# Altium schematic sheet [06] - HDMI OUTPUT.SchDoc
size A3; DocumentNumber: 6; SheetNumber: 6; SheetTotal: 18
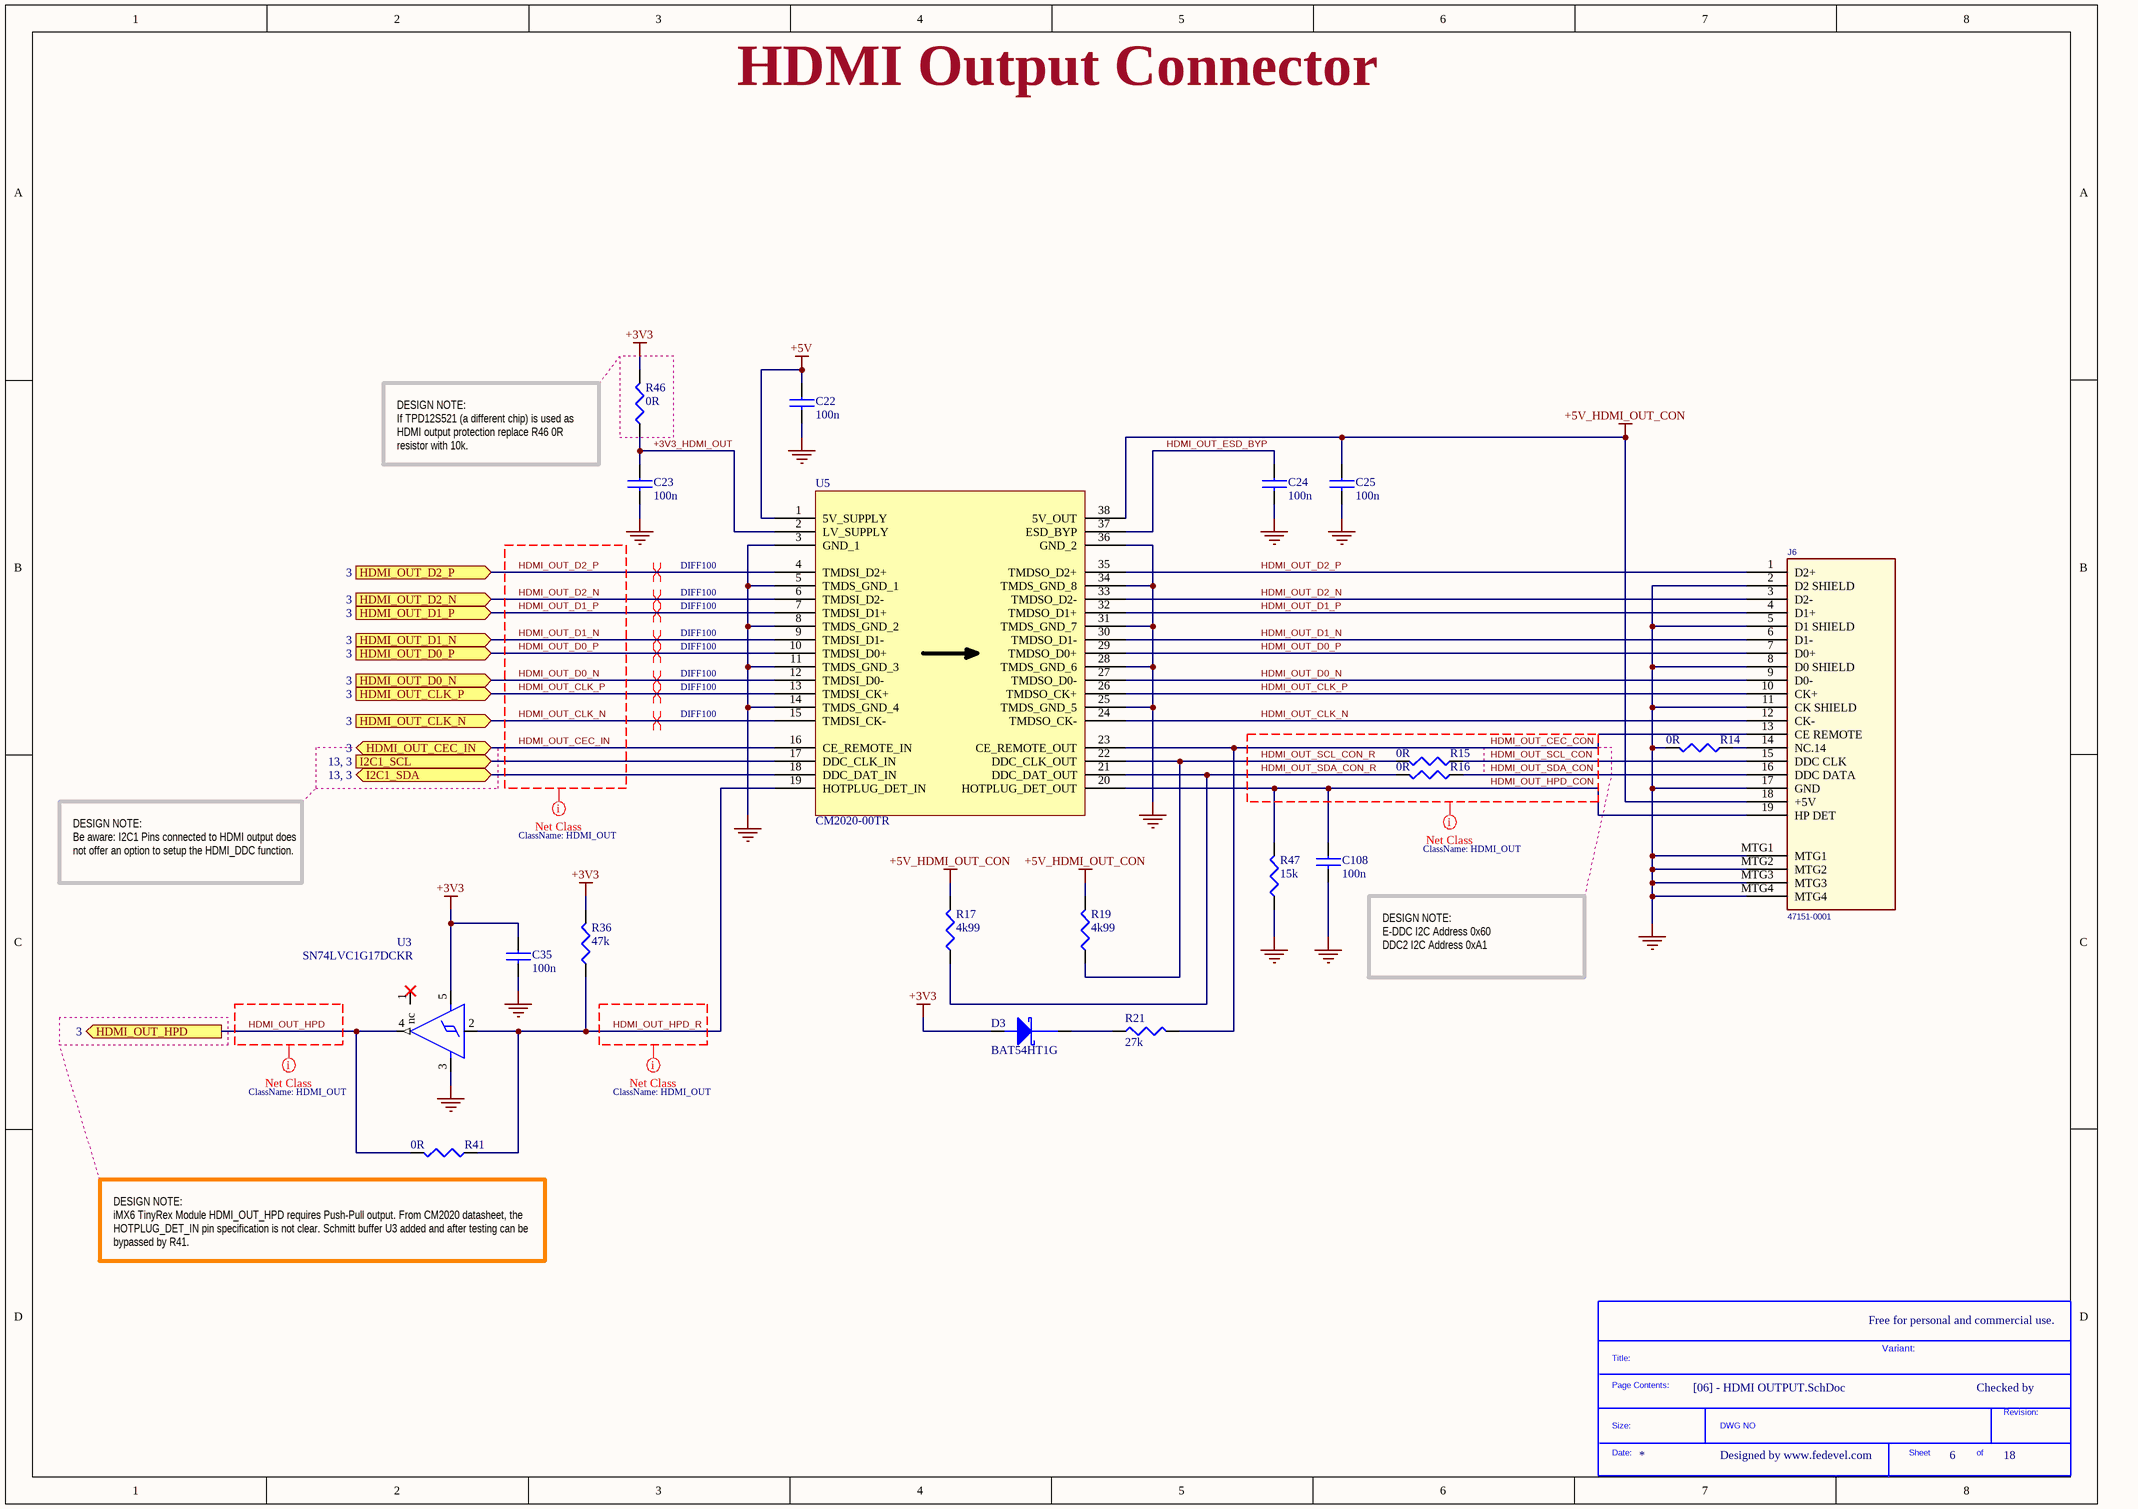
[diagram p0: [06] - HDMI OUTPUT.SchDoc]

## Parts
*  SDTitleBlock  (value not drawn)  (graphical)
C22  100n  [C0402]
C23  100n  [C0402]
C24  100n  [C0402]
C25  100n  [C0402]
C35  100n  [C0402]
C108  100n  [C0402]
D3  BAT54HT1G  [SOD323]
J6  47151-0001  [HDMI V1.1]
R14  0R  [R0402]
R15  0R  [R0402]
R16  0R  [R0402]
R17  4k99  [R0402]
R19  4k99  [R0402]
R21  27k  [R0402]
R36  47k  [R0402]
R41  0R  [R0402]
R46  0R  [R0402]
R47  15k  [R0402]
U3  SN74LVC1G17DCKR  [SC70_5]
U5  CM2020-00TR  [TSSOP_38]

## Ports
HDMI_OUT_CEC_IN (bidir, see 3), HDMI_OUT_CLK_N (in, see 3), HDMI_OUT_CLK_P (in, see 3), HDMI_OUT_D0_N (in, see 3), HDMI_OUT_D0_P (in, see 3), HDMI_OUT_D1_N (in, see 3), HDMI_OUT_D1_P (in, see 3), HDMI_OUT_D2_N (in, see 3), HDMI_OUT_D2_P (in, see 3), HDMI_OUT_HPD (out, see 3), I2C1_SCL (see 13, 3), I2C1_SDA (bidir, see 13, 3)

## Nets
+3V3: C35.1 D3.2(Anode) R36.2 R46.2 U3.5(NC1)
+5V: C22.1 U5.1(5V_SUPPLY)
+5V_HDMI_OUT_CON: C25.1 J6.18(+5V) R17.2 R19.2 U5.38(5V_OUT)
GND: C22.2 C23.2 C24.2 C25.2 C35.2 C108.2 J6.2(D2_SHIELD) J6.5(D1_SHIELD) J6.8(D0_SHIELD) J6.11(CK_SHIELD) J6.17(GND) J6.MTG1 J6.MTG2 J6.MTG3 J6.MTG4 R14.2 R47.1 U3.3(GND) U5.3(GND_1) U5.5(TMDS_GND_1) U5.8(TMDS_GND_2) U5.11(TMDS_GND_3) U5.14(TMDS_GND_4) U5.25(TMDS_GND_5) U5.28(TMDS_GND_6) U5.31(TMDS_GND_7) U5.34(TMDS_GND_8) U5.36(GND_2)
+3V3_HDMI_OUT: C23.1 R46.1 U5.2(LV_SUPPLY)
HDMI_OUT_CEC_CON: J6.13(CE_REMOTE) R21.2 U5.23(CE_REMOTE_OUT)
HDMI_OUT_CEC_IN: U5.16(CE_REMOTE_IN) ; port HDMI_OUT_CEC_IN
HDMI_OUT_CLK_N: J6.12(CK-) U5.15(TMDSI_CK-) U5.24(TMDSO_CK-) ; port HDMI_OUT_CLK_N
HDMI_OUT_CLK_P: J6.10(CK+) U5.13(TMDSI_CK+) U5.26(TMDSO_CK+) ; port HDMI_OUT_CLK_P
HDMI_OUT_D0_N: J6.9(D0-) U5.12(TMDSI_D0-) U5.27(TMDSO_D0-) ; port HDMI_OUT_D0_N
HDMI_OUT_D0_P: J6.7(D0+) U5.10(TMDSI_D0+) U5.29(TMDSO_D0+) ; port HDMI_OUT_D0_P
HDMI_OUT_D1_N: J6.6(D1-) U5.9(TMDSI_D1-) U5.30(TMDSO_D1-) ; port HDMI_OUT_D1_N
HDMI_OUT_D1_P: J6.4(D1+) U5.7(TMDSI_D1+) U5.32(TMDSO_D1+) ; port HDMI_OUT_D1_P
HDMI_OUT_D2_N: J6.3(D2-) U5.6(TMDSI_D2-) U5.33(TMDSO_D2-) ; port HDMI_OUT_D2_N
HDMI_OUT_D2_P: J6.1(D2+) U5.4(TMDSI_D2+) U5.35(TMDSO_D2+) ; port HDMI_OUT_D2_P
HDMI_OUT_ESD_BYP: C24.1 U5.37(ESD_BYP)
HDMI_OUT_HPD: R41.2 U3.4(O) ; port HDMI_OUT_HPD
HDMI_OUT_HPD_CON: C108.1 J6.19(HP_DET) R47.2 U5.20(HOTPLUG_DET_OUT)
HDMI_OUT_HPD_R: R36.1 R41.1 U3.2(I) U5.19(HOTPLUG_DET_IN)
HDMI_OUT_SCL_CON: J6.15(DDC_CLK) R15.1
HDMI_OUT_SCL_CON_R: R15.2 R19.1 U5.22(DDC_CLK_OUT)
HDMI_OUT_SDA_CON: J6.16(DDC_DATA) R16.1
HDMI_OUT_SDA_CON_R: R16.2 R17.1 U5.21(DDC_DAT_OUT)
I2C1_SCL: U5.17(DDC_CLK_IN) ; port I2C1_SCL
I2C1_SDA: U5.18(DDC_DAT_IN) ; port I2C1_SDA
NetD3_1: D3.1(Cathode) R21.1
NetJ6_14: J6.14(NC.14) R14.1

Not connected (* = marked no-connect by the designer): U3 1(nc)*

## Layout directives
differential pair; net class DIFF100: HDMI_OUT_CLK_N, HDMI_OUT_CLK_P, HDMI_OUT_D0_N, HDMI_OUT_D0_P, HDMI_OUT_D1_N, HDMI_OUT_D1_P, HDMI_OUT_D2_N, HDMI_OUT_D2_P
net class HDMI_OUT: HDMI_OUT_CEC_CON, HDMI_OUT_CEC_IN, HDMI_OUT_CLK_N, HDMI_OUT_CLK_P, HDMI_OUT_D0_N, HDMI_OUT_D0_P, HDMI_OUT_D1_N, HDMI_OUT_D1_P, HDMI_OUT_D2_N, HDMI_OUT_D2_P, HDMI_OUT_HPD, HDMI_OUT_HPD_CON, HDMI_OUT_HPD_R, HDMI_OUT_SCL_CON, HDMI_OUT_SCL_CON_R, HDMI_OUT_SDA_CON, HDMI_OUT_SDA_CON_R

## Notes on the sheet
- HDMI Output Connector
- DESIGN NOTE:
  If TPD12S521 (a different chip) is used as HDMI output protection replace R46 0R resistor with 10k.
- DESIGN NOTE:
  Be aware: I2C1 Pins connected to HDMI output does not offer an option to setup the HDMI_DDC function.
- DESIGN NOTE:
  E-DDC I2C Address 0x60
  DDC2 I2C Address 0xA1
- (near R41) DESIGN NOTE:
  iMX6 TinyRex Module HDMI_OUT_HPD requires Push-Pull output. From CM2020 datasheet, the HOTPLUG_DET_IN pin specification is not clear. Schmitt buffer U3 added and after testing can be bypassed by R41.
- Free for personal and commercial use.
- Variant:
- Checked by
- Designed by www.fedevel.com
- (in symbol SDTitleBlock) Title:; Page Contents:; Revision:; Size:; DWG NO; Date:; Sheet; of

## Library data of the parts
C22-C25 C35 C108 = C1005X5R1H104K: CAP CER .10UF 50V X5R 10% 0402; Manufacturer: TDK Corporation; Capacitance: 0.1µF; Value: 100nF; .Checked PCB: used; Category: Capacitors; Supplier Part Number: 445-5942-1-ND; Manufacturer Part Number: C1005X5R1H104K; Operating Temperature: -55°C ~ 85°C; Package / Case: 0402 (1005 Metric); Price 1k [$]: 0.02340; .Checked SCH: used; Voltage - Rated: 50V; Supplier: Digikey; Supplier 1: Digi-Key; Supplier Part Number 1: 445-5942-1-ND; RoHS: RoHS Compliant; Stock 1: 106926; Pricing 1: 1=0.27, 10=0.18, 100=0.072, 250=0.05176, 500=0.0369, 1000=0.027 (USD); Tolerance: ±10%; Temperature Coefficient: X5R; Mounting Type: Surface Mount, MLCC; Applications: General Purpose; Ratings: -; Size / Dimension: 0.039" L x 0.020" W (1.00mm x 0.50mm); Height - Seated (Max): -; Thickness (Max): 0.022" (0.55mm); Lead Spacing: -; Features: -; Packaging: Cut Tape (CT); Lead Style: -; ComponentLink1URL: http://www.tdk.co.jp/tefe02/e412_c.pdf; ComponentLink1Description: http://www.tdk.co.jp/tefe02/e412_c.pdf
D3 = BAT54HT1G: DIODE SCHOTTKY 30V 0.2A SOD323; Manufacturer: Fairchild Semiconductor; Current - Average Rectified (Io): 200mA; Voltage - Forward (Vf) (Max) @ If: 800mV @ 100mA; Speed: Small Signal =< 200mA (Io), Any Speed; Reverse Recovery Time (trr): 5ns; Current - Reverse Leakage @ Vr: 2µA @ 25V; Capacitance @ Vr, F: 10pF @ 1V, 1MHz; Thermal Resistance: 600°C/W Ja; .Creator: MM; .Checked PCB: used; Supplier 1: Digi-Key; Manufacturer Part Number: BAT54HT1G; RoHS: RoHS Compliant; Category: Discrete Semiconductor Products; Stock 1: 11388; Pricing 1: 1=0.3, 10=0.276, 25=0.1984, 100=0.1543, 250=0.09696, 500=0.0826, 1000=0.05628 (USD); Packaging: Cut Tape (CT); Diode Type: Schottky; Voltage - DC Reverse (Vr) (Max): 30V; Mounting Type: Surface Mount; Package / Case: SC-76, SOD-323; Supplier Device Package: SOD-323; Operating Temperature - Junction: -55°C ~ 150°C; ComponentLink1URL: http://www.fairchildsemi.com/ds/BA/BAT54HT1G.pdf; ComponentLink1Description: http://www.fairchildsemi.com/ds/BA/BAT54HT1G.pdf; Supplier Part Number 1: BAT54HT1GCT-ND; .Checked SCH: used
J6 = 47151-0001_v1.1: CONN RCPT 19POS HDMI RT ANG SMD; Manufacturer: Molex Connector Corporation; .Checked PCB: MM; Number of Positions: 19; Pitch: 0.50mm (.020"); Gender: Receptacle; .Version: V1.1 - Changed holes to slots; .Checked SCH: MM; Category: Connectors, Interconnects; Connector Type: HDMI; Family: USB, IEEE-1394 (Firewire), DVI, HDMI; Manufacturer Part Number: 47151-0001; Operating Temperature: -20°C to +85°C; Price 1k [$]: 1.74610; Supplier: Digikey; Supplier Part Number: WM19086CT-ND; Value: 47151-0001; Supplier 1: Digi-Key; Supplier Part Number 1: WM19086CT-ND; RoHS: RoHS Compliant; Stock 1: 2756; Pricing 1: 1=3.1, 10=2.57, 50=2.1456, 100=1.9034 (USD); Number of Contacts: 19; Specifications: -; Mounting Type: Surface Mount, Right Angle, Horizontal; Features: Detent Lock; Packaging: Cut Tape (CT); Ingress Protection: -; ComponentLink1URL: http://www.molex.com/pdm_docs/sd/471510001_sd.pdf; ComponentLink1Description: http://www.molex.com/pdm_docs/sd/471510001_sd.pdf
R14-R16 R41 R46 = RC0402JR-070RL: RES 0.0 OHM 1/16W 0402 SMD; Manufacturer: Yageo; Resistance (Ohms): 0.0; Power (Watts): 0.063W, 1/16W; Tolerance: Jumper; .Checked PCB: used; Category: Resistors; Manufacturer Part Number: RC0402JR-070RL; Package / Case: 0402 (1005 Metric); Price 1k [$]: 0.01389; Value: 0R; .Checked SCH: used; Supplier Part Number: 311-0.0JRCT-ND; Supplier: Digikey; Supplier 1: Digi-Key; Supplier Part Number 1: 311-0.0JRCT-ND; RoHS: RoHS Compliant; Stock 1: 1106330; Pricing 1: 10=0.012, 50=0.009, 100=0.0069, 250=0.00512, 500=0.0038, 1000=0.00253 (USD); Composition: Thick Film; Features: -; Temperature Coefficient: -; Size / Dimension: 0.039" L x 0.020" W (1.00mm x 0.50mm); Height: 0.016" (0.40mm); Number of Terminations: 2; Packaging: Cut Tape (CT); ComponentLink1URL: http://www.yageo.com/documents/recent/PYu-RC0402_51_RoHS_L_6.pdf; ComponentLink1Description: http://www.yageo.com/documents/recent/PYu-RC0402_51_RoHS_L_6.pdf
R17 R19 = RMCF0402FT4K99: RES TF 4.99K OHM 1% 1/16W 0402; Manufacturer: Stackpole Electronics Inc; Power (Watts): 0.063W, 1/16W; .Checked PCB: used; Temperature Coefficient: ±100ppm/°C; Category: Resistors; Supplier Part Number: RMCF0402FT4K99CT-ND; Manufacturer Part Number: RMCF0402FT4K99; Package / Case: 0402 (1005 Metric); Price 1k [$]: 0.00384; Resistance (Ohms): 4.99K; Tolerance: ±1%; Value: 4k99; .Checked SCH: used; Supplier: Digikey; Supplier 1: Digi-Key; Supplier Part Number 1: RMCF0402FT4K99CT-ND; RoHS: RoHS Compliant; Stock 1: 48509; Pricing 1: 1=0.04, 10=0.025, 50=0.0138, 100=0.0105, 250=0.0078, 500=0.00576, 1000=0.00384 (USD); Composition: Thick Film; Features: -; Size / Dimension: 0.039" L x 0.020" W (1.00mm x 0.50mm); Height: 0.016" (0.40mm); Number of Terminations: 2; Packaging: Cut Tape (CT); ComponentLink1URL: http://www.seielect.com/Catalog/SEI-RMCF.pdf; ComponentLink1Description: http://www.seielect.com/Catalog/SEI-RMCF.pdf
R21 = RC0402FR-0727KL: RES 27.0K OHM 1/16W 1% 0402 SMD; Manufacturer: Yageo; Power (Watts): 0.063W, 1/16W; .Checked PCB: used; Temperature Coefficient: ±100ppm/°C; Category: Resistors; Supplier Part Number: 311-27.0KLRCT-ND; Manufacturer Part Number: RC0402FR-0727KL; Package / Case: 0402 (1005 Metric); Price 1k [$]: 0.00288; Resistance (Ohms): 27K; Tolerance: ±1%; Value: 27k; .Checked SCH: used; Supplier: Digikey; Supplier 1: Digi-Key; Supplier Part Number 1: 311-27.0KLRCT-ND; RoHS: RoHS Compliant; Stock 1: 21638; Pricing 1: 10=0.014, 50=0.0104, 100=0.0079, 250=0.00584, 500=0.00432, 1000=0.00288 (USD); Composition: Thick Film; Features: -; Size / Dimension: 0.039" L x 0.020" W (1.00mm x 0.50mm); Height: 0.016" (0.40mm); Number of Terminations: 2; Packaging: Cut Tape (CT); ComponentLink1URL: http://www.yageo.com/documents/recent/PYu-RC0402_51_RoHS_L_6.pdf; ComponentLink1Description: http://www.yageo.com/documents/recent/PYu-RC0402_51_RoHS_L_6.pdf
R36 = RC0402FR-0747KL: RES 47.0K OHM 1/16W 1% 0402 SMD; Manufacturer: Yageo; Power (Watts): 0.063W, 1/16W; .Checked PCB: used; Temperature Coefficient: ±100ppm/°C; Category: Resistors; Supplier Part Number: 311-47.0KLRCT-ND; Manufacturer Part Number: RC0402FR-0747KL; Package / Case: 0402 (1005 Metric); Price 1k [$]: 0.01421; Resistance (Ohms): 47K; Tolerance: ±1%; Value: 47k; .Checked SCH: used; Supplier: Digikey; Supplier 1: Digi-Key; Supplier Part Number 1: 311-47.0KLRCT-ND; RoHS: RoHS Compliant; Stock 1: 1227580; Pricing 1: 10=0.014, 50=0.0104, 100=0.0079, 250=0.00584, 500=0.00432, 1000=0.00288 (USD); Composition: Thick Film; Features: -; Size / Dimension: 0.039" L x 0.020" W (1.00mm x 0.50mm); Height: 0.016" (0.40mm); Number of Terminations: 2; Packaging: Cut Tape (CT); ComponentLink1URL: http://www.yageo.com/documents/recent/PYu-RC0402_51_RoHS_L_6.pdf; ComponentLink1Description: http://www.yageo.com/documents/recent/PYu-RC0402_51_RoHS_L_6.pdf
R47 = RC0402FR-0715KL: RES 15.0K OHM 1/16W 1% 0402 SMD; Manufacturer: Yageo; Power (Watts): 0.063W, 1/16W; .Checked PCB: used; Temperature Coefficient: ±100ppm/°C; Category: Resistors; Supplier Part Number: 311-15.0KLRCT-ND; Manufacturer Part Number: RC0402FR-0715KL; Package / Case: 0402 (1005 Metric); Price 1k [$]: 0.01421; Resistance (Ohms): 15K; Tolerance: ±1%; Value: 15k; .Checked SCH: used; Supplier: Digikey; Supplier 1: Digi-Key; Supplier Part Number 1: 311-15.0KLRCT-ND; RoHS: RoHS Compliant; Stock 1: 31992; Pricing 1: 10=0.014, 50=0.0104, 100=0.0079, 250=0.00584, 500=0.00432, 1000=0.00288 (USD); Composition: Thick Film; Features: -; Size / Dimension: 0.039" L x 0.020" W (1.00mm x 0.50mm); Height: 0.016" (0.40mm); Number of Terminations: 2; Packaging: Cut Tape (CT); ComponentLink1URL: http://www.yageo.com/documents/recent/PYu-RC0402_51_RoHS_L_6.pdf; ComponentLink1Description: http://www.yageo.com/documents/recent/PYu-RC0402_51_RoHS_L_6.pdf
U3 = SN74LVC1G17DCKR: IC BUFFER SCHMIT TRIG SC705; Manufacturer: Texas Instruments; Logic Type: Schmitt Trigger - Buffer, Driver; Number of Elements: 1; Current - Output High, Low: 32mA, 32mA; Voltage - Supply: 1.65 V ~ 5.5 V; .Checked PCB: RF; Supplier 1: Digi-Key; Supplier Part Number 1: 296-11934-1-ND; Manufacturer Part Number: SN74LVC1G17DCKR; RoHS: RoHS Compliant; Category: Integrated Circuits (ICs); Stock 1: 50549; Pricing 1: 1=0.12, 10=0.097, 25=0.086, 100=0.0581, 250=0.05696, 500=0.0559, 750=0.05483 (USD); Number of Bits per Element: 1; Operating Temperature: -40°C ~ 85°C; Mounting Type: Surface Mount; Package / Case: 6-TSSOP (5 Lead), SC-88A, SOT-353; Supplier Device Package: SC-70-5; Packaging: Cut Tape (CT); ComponentLink1URL: http://www.ti.com/lit/ds/symlink/sn74lvc1g17.pdf; ComponentLink1Description: http://www.ti.com/lit/ds/symlink/sn74lvc1g17.pdf; .Checked SCH: RF
U5 = CM2020-00TR: IC HDMI TX PORT P/I 38-TSSOP; Manufacturer: ON Semiconductor; .Creator: MM; .Checked PCB: used; Supplier 1: Digi-Key; Manufacturer Part Number: CM2020-00TR; RoHS: RoHS Compliant; Category: Integrated Circuits (ICs); Stock 1: 7580; Pricing 1: 1=1.52, 10=1.34, 25=1.2096, 100=1.0584, 250=0.9282, 500=0.8232, 1000=0.651 (USD); Packaging: Cut Tape (CT); Type: HDMI Transmitter; Applications: Consumer Electronics, DVD-RW Players, Set Top Box; Mounting Type: Surface Mount; Package / Case: 38-TFSOP (0.173", 4.40mm Width) Exposed Pad; Supplier Device Package: 38-TSSOP; ComponentLink1URL: http://www.onsemi.com/pub_link/Collateral/CM2020-00TR-D.PDF; ComponentLink1Description: http://www.onsemi.com/pub_link/Collateral/CM2020-00TR-D.PDF; Supplier Part Number 1: CM2020-00TROSCT-ND; .Checked SCH: used